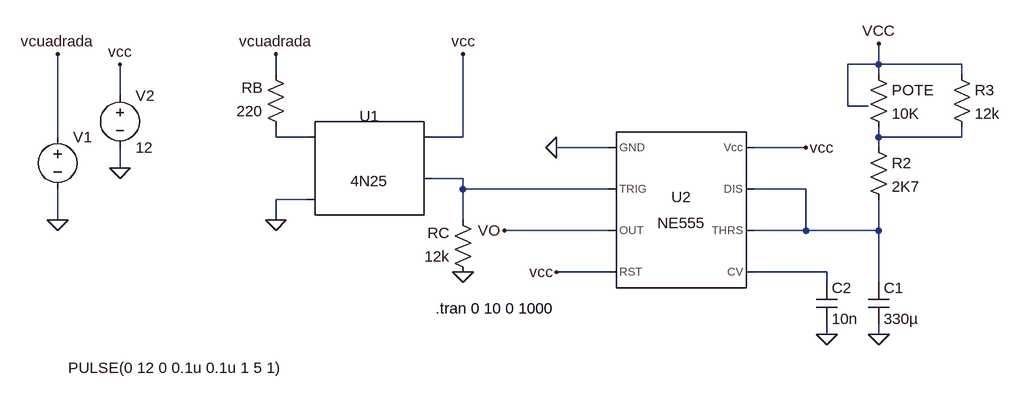
[diagram p0: schematic Barrera Infrarroja.asc]
Barrera Infrarroja.asc, the LTspice schematic file:
Version 4
SHEET 1 3044 692
WIRE 1392 -144 1392 -176
WIRE 1392 -144 1344 -144
WIRE 1520 -144 1392 -144
WIRE 464 -128 464 -160
WIRE 1392 -128 1392 -144
WIRE 1520 -128 1520 -144
WIRE 224 -96 224 -144
WIRE 1344 -80 1344 -144
WIRE 1376 -80 1344 -80
WIRE 128 -32 128 -160
WIRE 464 -32 464 -48
WIRE 512 -32 464 -32
WIRE 752 -32 752 -160
WIRE 752 -32 704 -32
WIRE 1392 -32 1392 -48
WIRE 1520 -32 1520 -48
WIRE 1520 -32 1392 -32
WIRE 976 -16 896 -16
WIRE 1280 -16 1200 -16
WIRE 1392 -16 1392 -32
WIRE 224 16 224 -16
WIRE 752 32 704 32
WIRE 752 48 752 32
WIRE 976 48 752 48
WIRE 1280 48 1200 48
WIRE 512 64 464 64
WIRE 128 96 128 48
WIRE 464 96 464 64
WIRE 752 96 752 48
WIRE 976 112 816 112
WIRE 1280 112 1280 48
WIRE 1280 112 1200 112
WIRE 1392 112 1392 64
WIRE 1392 112 1280 112
WIRE 976 176 896 176
WIRE 1312 176 1200 176
WIRE 1312 192 1312 176
WIRE 1392 192 1392 112
WIRE 1312 272 1312 256
WIRE 1392 272 1392 256
FLAG 464 96 0
FLAG 752 176 0
FLAG 128 96 0
FLAG 128 -160 vcuadrada
FLAG 464 -160 vcuadrada
FLAG 752 -160 vcc
FLAG 1280 -16 vcc
FLAG 896 176 vcc
FLAG 896 -16 0
FLAG 1392 272 0
FLAG 1392 -176 VCC
FLAG 816 112 VO
FLAG 224 16 0
FLAG 224 -144 vcc
FLAG 1312 272 0
SYMBOL res 480 -32 R180
WINDOW 0 36 76 Left 2
WINDOW 3 36 40 Left 2
SYMATTR InstName RB
SYMATTR Value 220
SYMBOL res 768 192 R180
WINDOW 0 36 76 Left 2
WINDOW 3 36 40 Left 2
SYMATTR InstName RC
SYMATTR Value 12k
SYMBOL voltage 128 -48 R0
WINDOW 3 16 371 Left 2
WINDOW 123 0 0 Left 0
WINDOW 39 0 0 Left 0
SYMATTR InstName V1
SYMATTR Value PULSE(0 12 0 0.1u 0.1u 1 5 1)
SYMBOL Optos\\4N25 608 32 R0
WINDOW 0 0 -96 Center 2
SYMATTR InstName U1
SYMBOL Misc\\NE555 1088 80 R0
SYMATTR InstName U2
SYMBOL res 1376 -144 R0
WINDOW 0 36 40 Left 2
WINDOW 3 36 76 Left 2
SYMATTR InstName POTE
SYMATTR Value 10K
SYMBOL res 1376 -32 R0
WINDOW 0 36 40 Left 2
WINDOW 3 36 76 Left 2
SYMATTR InstName R2
SYMATTR Value 2K7
SYMBOL res 1504 -144 R0
WINDOW 0 36 40 Left 2
WINDOW 3 36 76 Left 2
SYMATTR InstName R3
SYMATTR Value 12k
SYMBOL voltage 224 -112 R0
WINDOW 123 0 0 Left 0
WINDOW 39 0 0 Left 0
SYMATTR InstName V2
SYMATTR Value 12
SYMBOL cap 1296 192 R0
SYMATTR InstName C2
SYMATTR Value 10n
SYMBOL cap 1376 192 R0
SYMATTR InstName C1
SYMATTR Value 330µ
TEXT 710 232 Left 2 !.tran 0 10 0 1000

The netlist it stands for:
* Barrera Infrarroja.asc
RB N001 vcuadrada 220
RC 0 N003 12k
V1 vcuadrada 0 PULSE(0 12 0 0.1u 0.1u 1 5 1)
XU1 N001 0 vcc N003 NC_01 4N25
XU2 0 N003 VO vcc N005 N004 N004 vcc NE555  ; pins GND TRIG OUT RST CV THRS DIS Vcc
R§POTE vcc N002 10K
R2 N002 N004 2K7
R3 vcc N002 12k
V2 vcc 0 12
C2 N005 0 10n
C1 N004 0 330µ
.tran 0 10 0 1000
.lib 4N25.sub
.lib NE555.sub
.backanno
.end